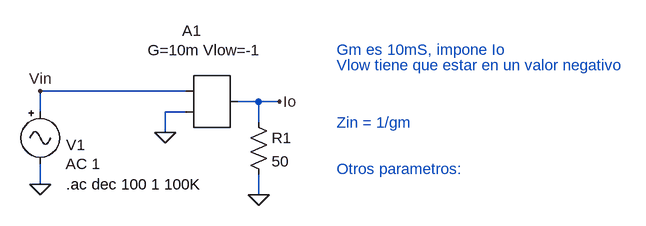
[diagram p0: schematic ota ideal.asc]
ota ideal.asc, the LTspice schematic file:
Version 4
SHEET 1 940 680
WIRE 208 160 -16 160
WIRE 320 176 288 176
WIRE 352 176 320 176
WIRE -16 192 -16 160
WIRE 208 192 176 192
WIRE 320 208 320 176
WIRE 176 224 176 192
WIRE -16 304 -16 272
WIRE 320 320 320 288
FLAG 176 224 0
FLAG -16 304 0
FLAG 352 176 Io
FLAG 320 320 0
FLAG -16 160 Vin
SYMBOL SpecialFunctions\\ota 240 240 M180
WINDOW 0 -38 173 Left 2
WINDOW 3 -91 143 Left 2
SYMATTR InstName A1
SYMATTR Value G=10m Vlow=-1
SYMBOL Misc\\signal -16 176 R0
WINDOW 0 40 67 Left 2
WINDOW 3 42 97 Left 2
WINDOW 123 39 96 Left 2
WINDOW 39 0 0 Left 0
SYMATTR InstName V1
SYMATTR Value ""
SYMATTR Value2 AC 1
SYMBOL res 304 192 R0
SYMATTR InstName R1
SYMATTR Value 50
TEXT 24 304 Left 2 !.ac dec 100 1 100K
TEXT 440 96 Left 2 ;Gm es 10mS, impone Io
TEXT 440 120 Left 2 ;Vlow tiene que estar en un valor negativo
TEXT 440 208 Left 2 ;Zin = 1/gm
TEXT 440 280 Left 2 ;Otros parametros:

The netlist it stands for:
* ota ideal.asc
A1 0 Vin 0 0 0 0 Io 0 OTA G=10m Vlow=-1
V1 Vin 0 AC 1
R1 Io 0 50
.ac dec 100 1 100K
* Gm es 10mS, impone Io
* Vlow tiene que estar en un valor negativo
* Zin = 1/gm
* Otros parametros:
.backanno
.end